# EAGLE design power_connector (EAGLE 8.6.0)
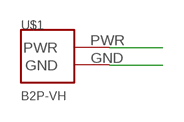
[diagram p0: schematic, sheet 1]

## Parts
U$1  B2P-VH  [B2P-VH]

## Nets
GND: U$1.GND
PWR: U$1.PWR

## Library data of the parts
U$1 = avocado:B2P-VH

## Board
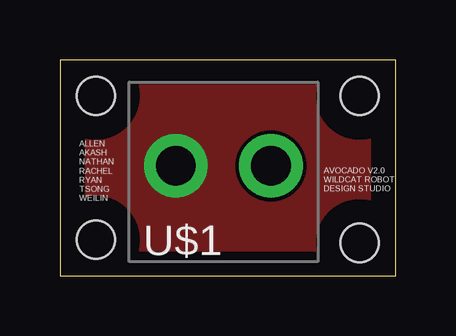
[diagram p1: board, top side]
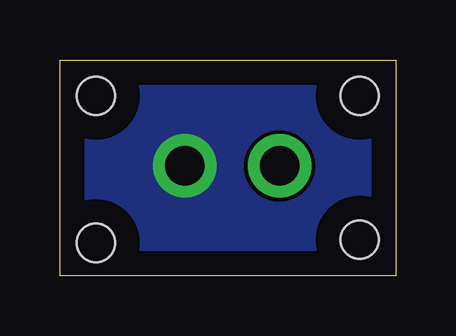
[diagram p2: board, bottom side, seen from below]

Size 14 x 9 mm. Coordinates in mm from the lower left corner, seen from the top.
Outline: 0,0 14,0 14,9 0,9 0,0
Copper layers (1*16): Top 0.035mm / dielectric 1.5mm / Bottom 0.035mm
Design rules "default": minimum track width 6mil, minimum drill 0.35mm, track to track 6mil, track to pad 6mil, pad to pad 6mil, via to via 6mil, smd to smd 6mil, copper to edge 40mil, drill to drill 6mil, minimum pad ring 10mil, minimum via ring 8mil, stop-mask expansion 4mil, vias tented up to drill 0mil, thermal gap 10mil
Holes 1.6 mm at 1.5,1.5 12.5,1.37 12.5,7.5 1.5,7.5

### Footprints (pad centres in the part's own frame; a part is rotated, then mirrored left to right if it is on the bottom)
B2P-VH = drill 1.65 pad 2.65: GND 1.98,0; PWR -1.98,0

### Placement (x,y rotation side)
U$1  6.82,4.58 0 top

### Tracks (layer width: path | path; a pad name or v marks a point on that pad's centre or on a via)
GND
  pour Bottom (no thermals): -0.7,9.5 -0.7,-1.1 2.9,-1.1 15.4,-1.1 15.4,-0.3 15.4,9.7 14.9,9.7 -0.7,9.7
PWR
  pour Top (no thermals): -0.4,9.4 15,9.4 15,-0.9 -0.4,-0.9

### Text on the board
tPlace: AVOCADO V2.0 / WILDCAT ROBOT / DESIGN STUDIO | ALLEN / AKASH / NATHAN / RACHEL / RYAN / TSONG / WEILIN